# EAGLE schematic dmgK_v17 (EAGLE 9.7.0)
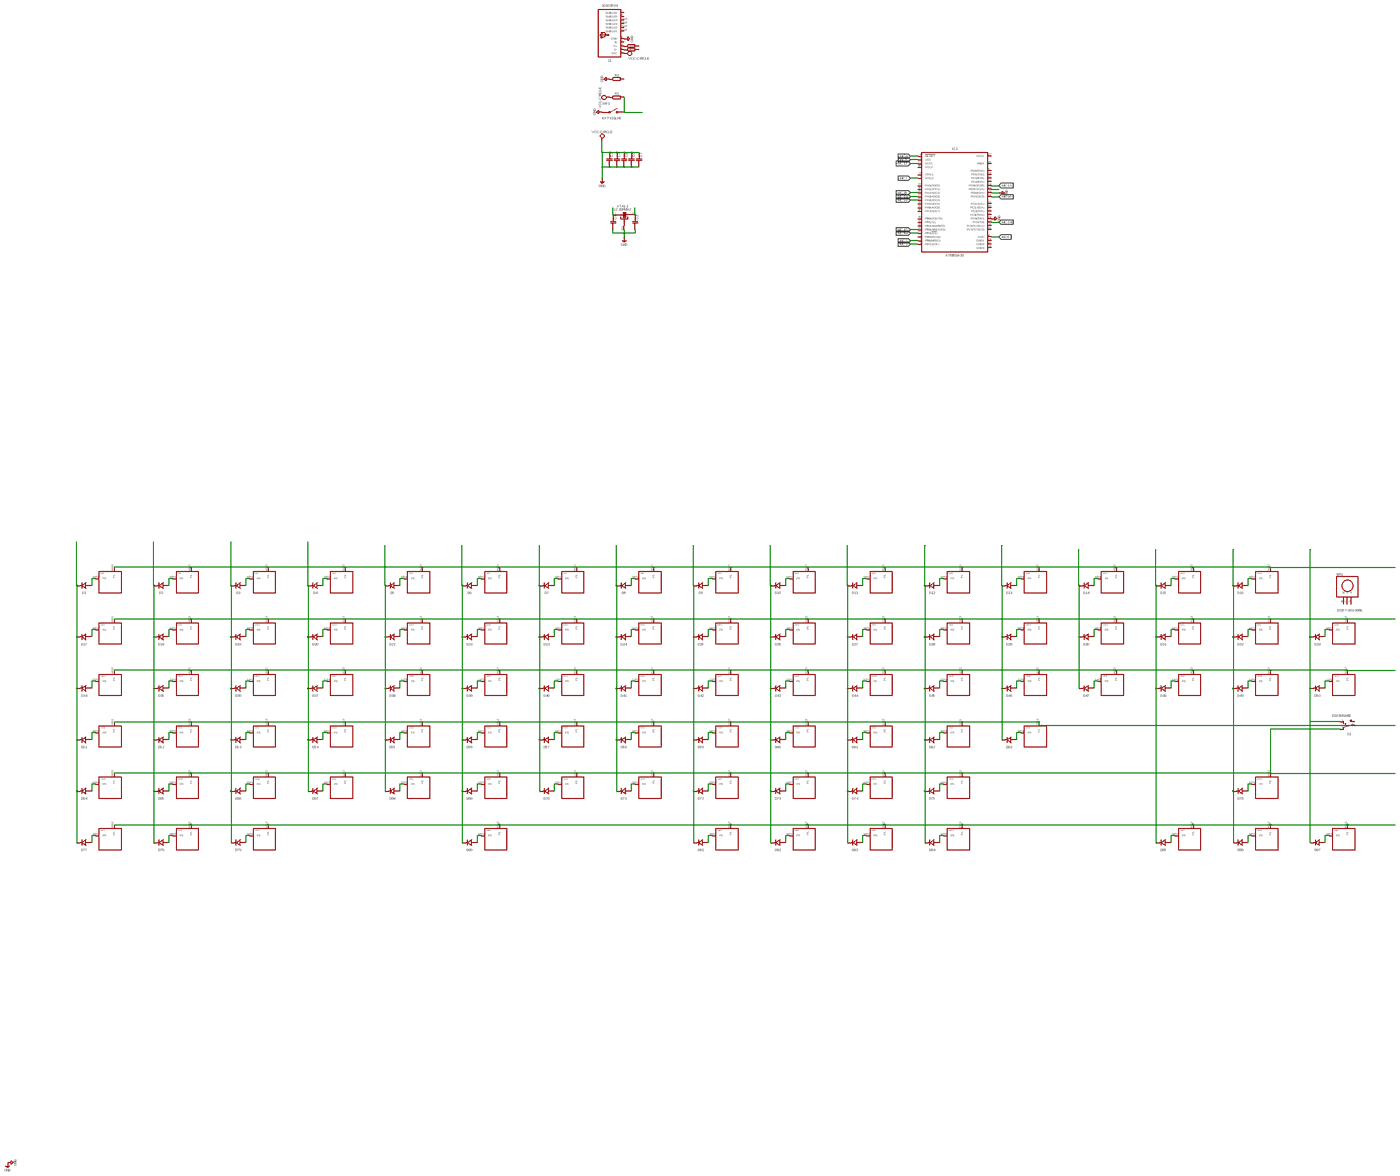
[diagram p0: schematic, sheet 1, overview]
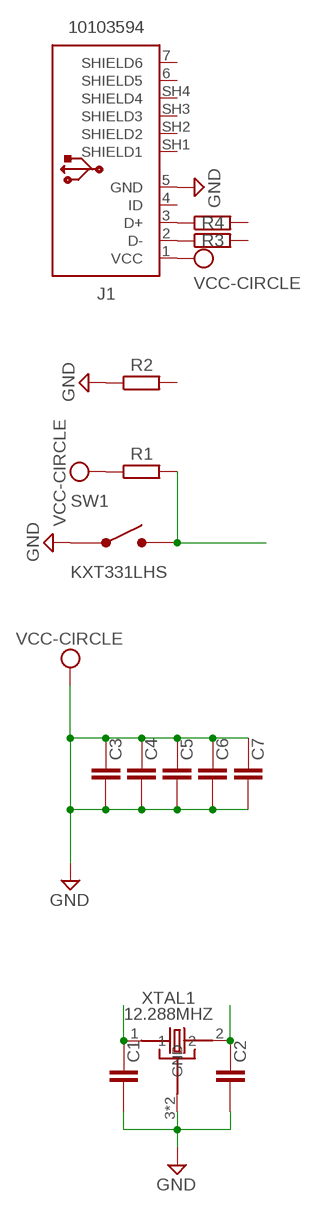
[diagram p1: schematic, sheet 1, part 1 of 6]
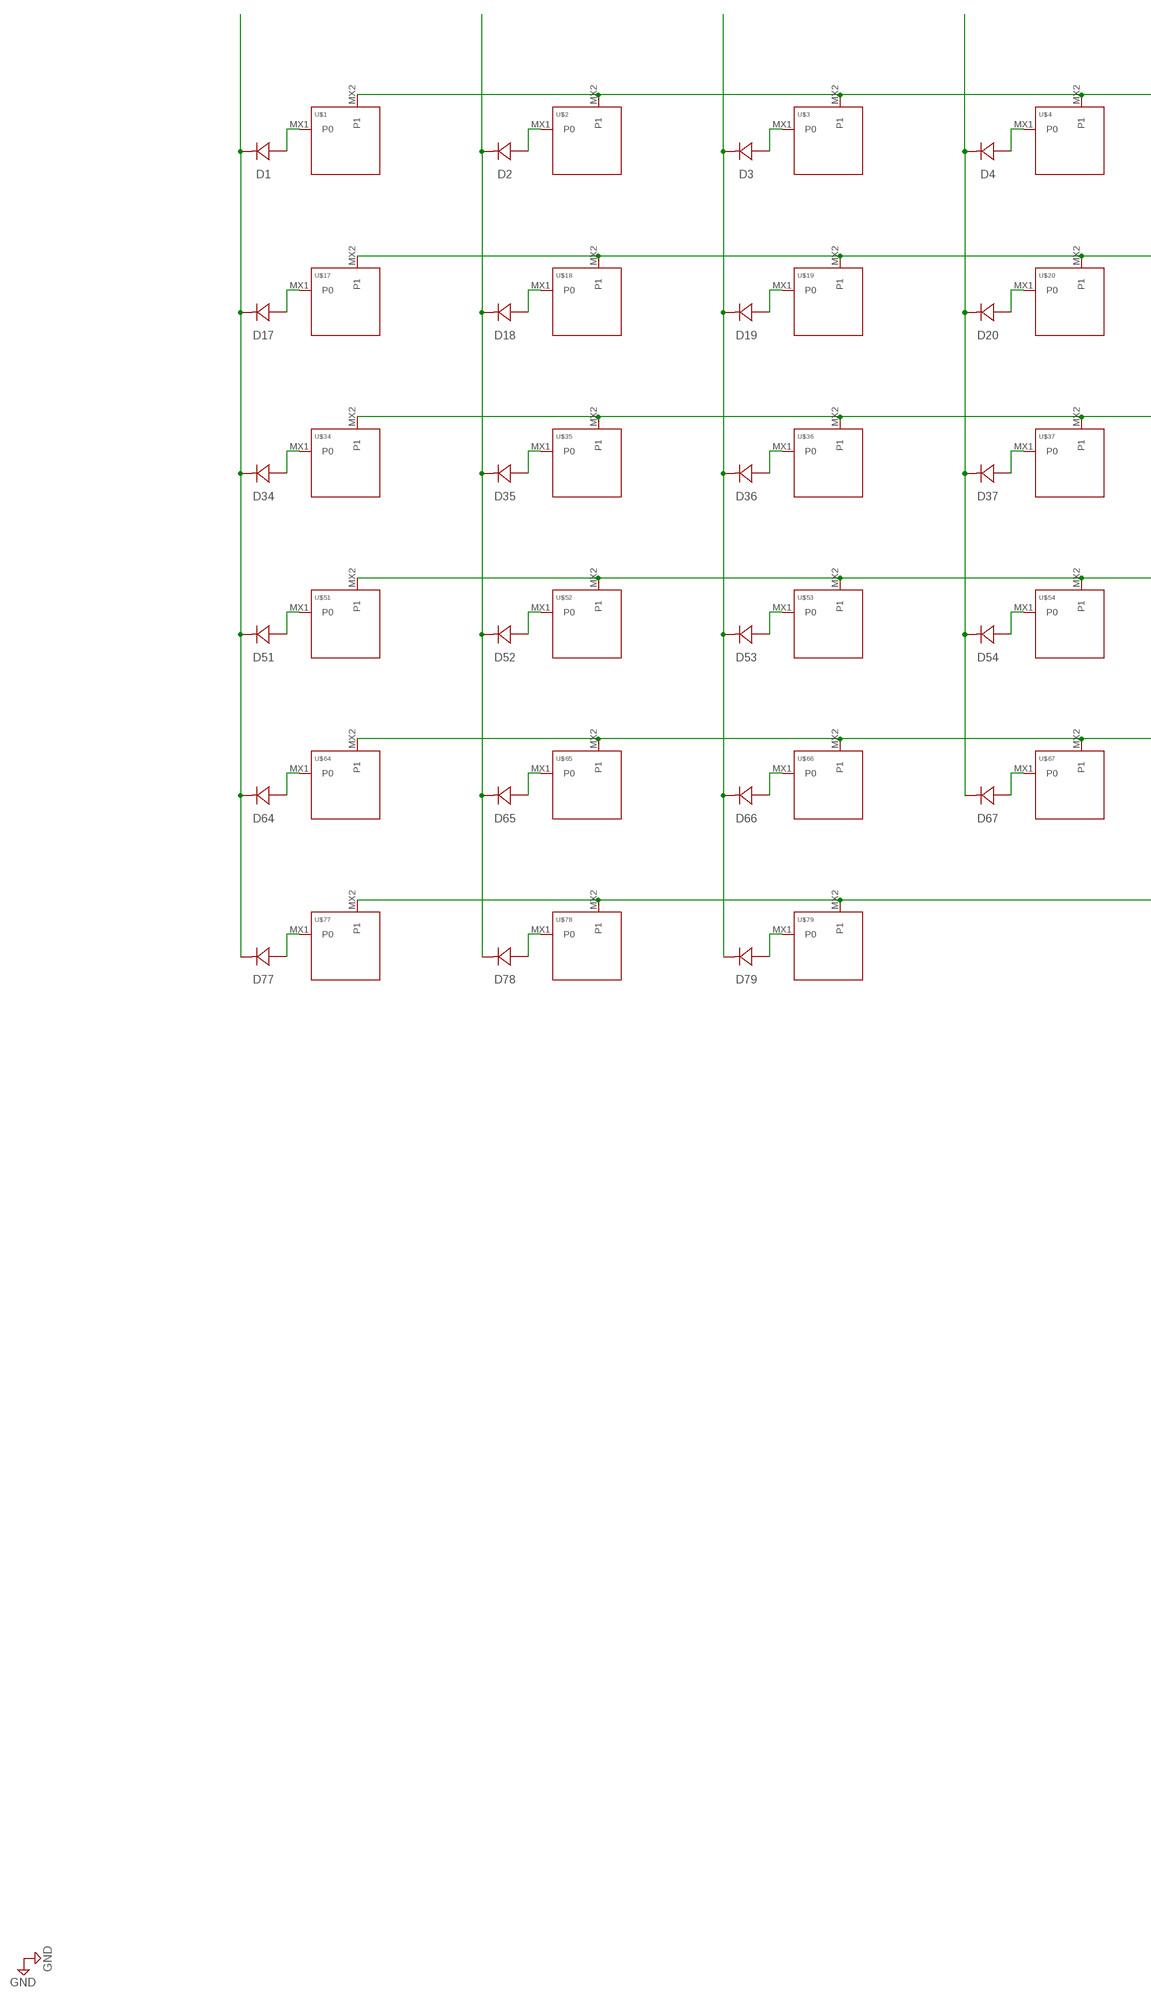
[diagram p2: schematic, sheet 1, part 2 of 6]
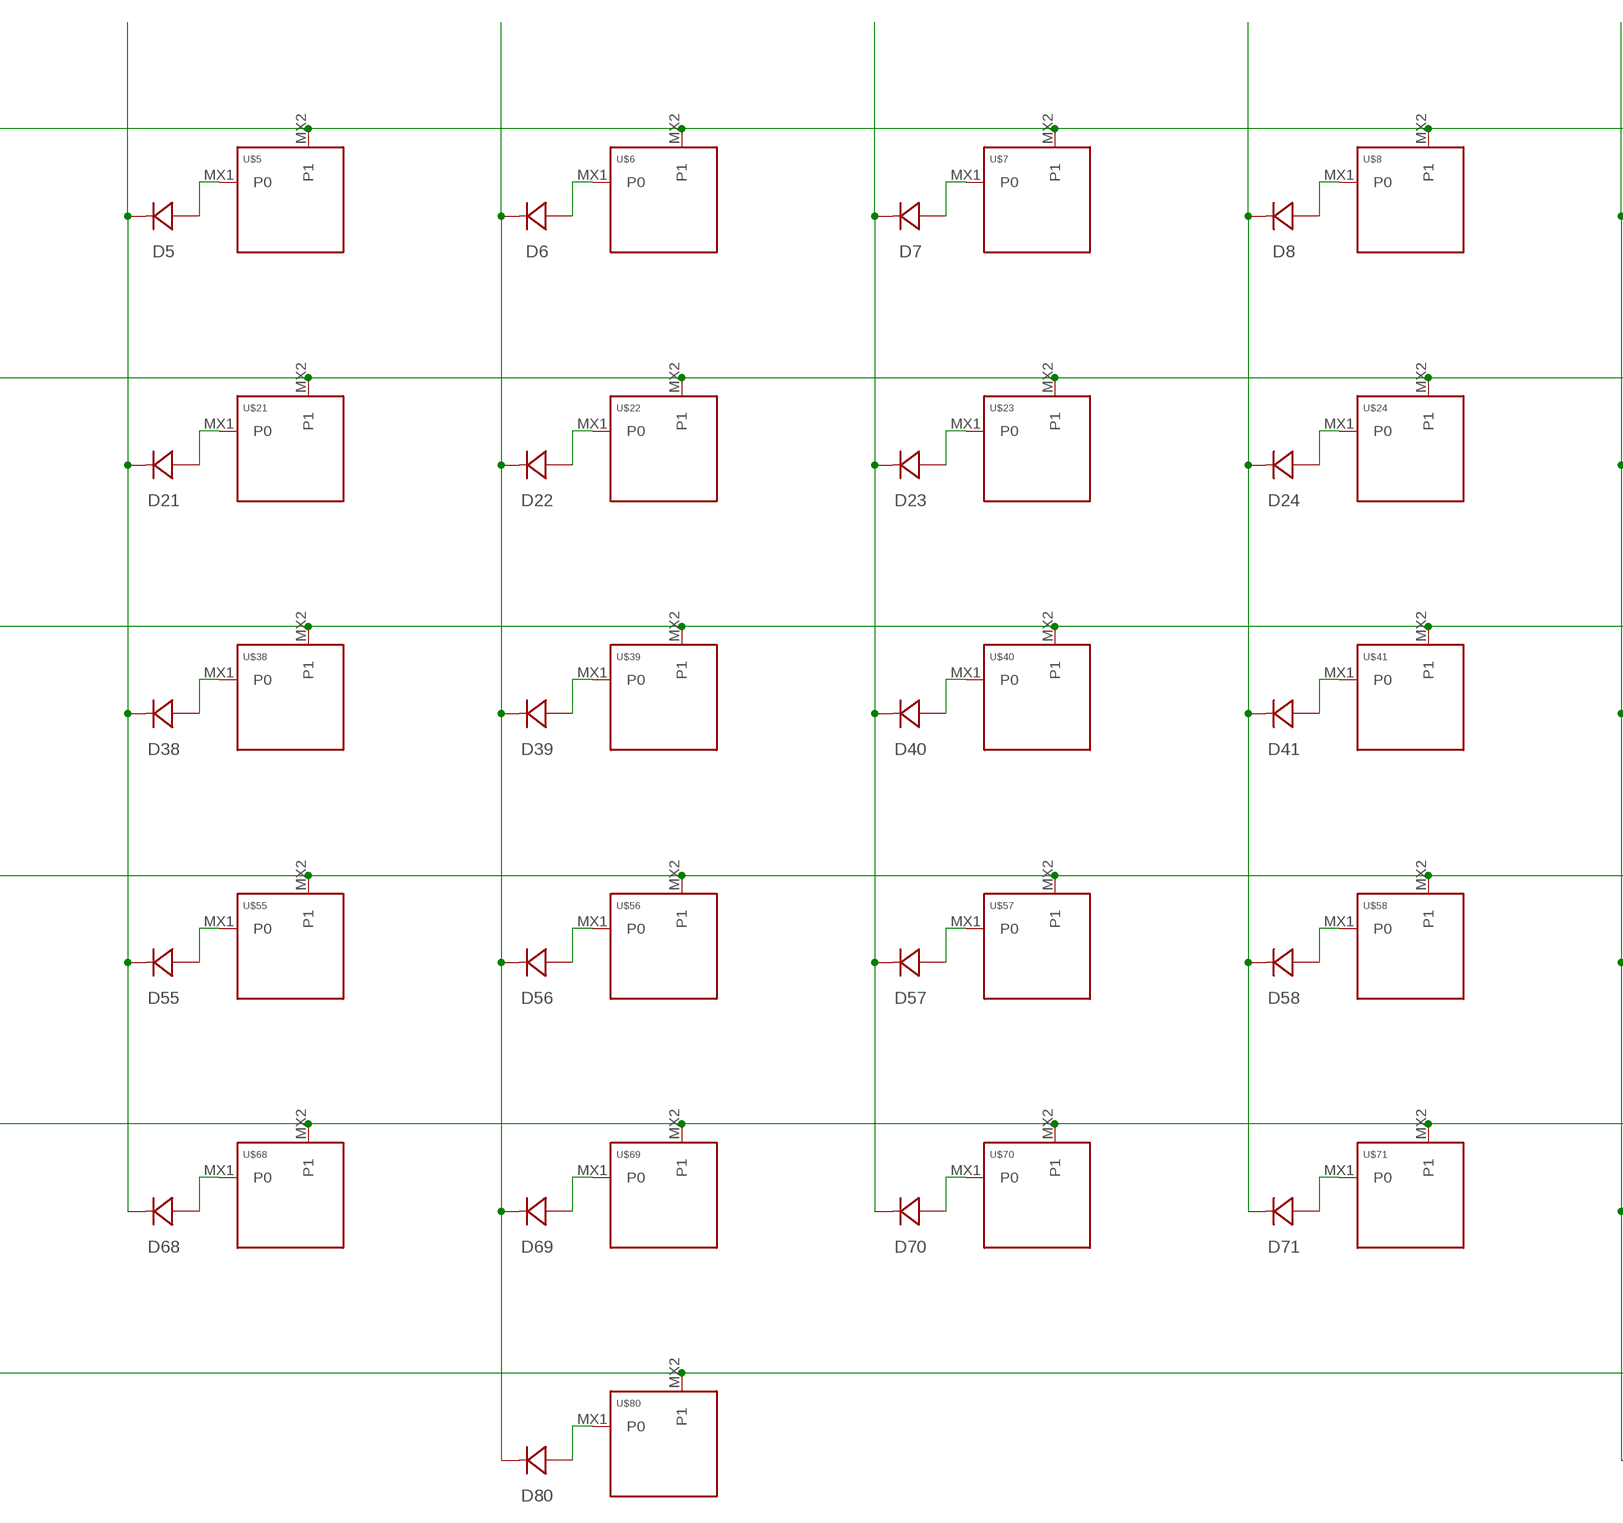
[diagram p3: schematic, sheet 1, part 3 of 6]
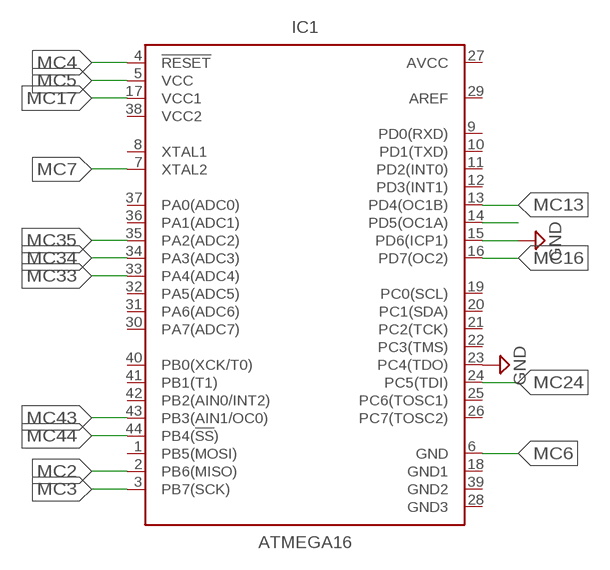
[diagram p4: schematic, sheet 1, part 4 of 6]
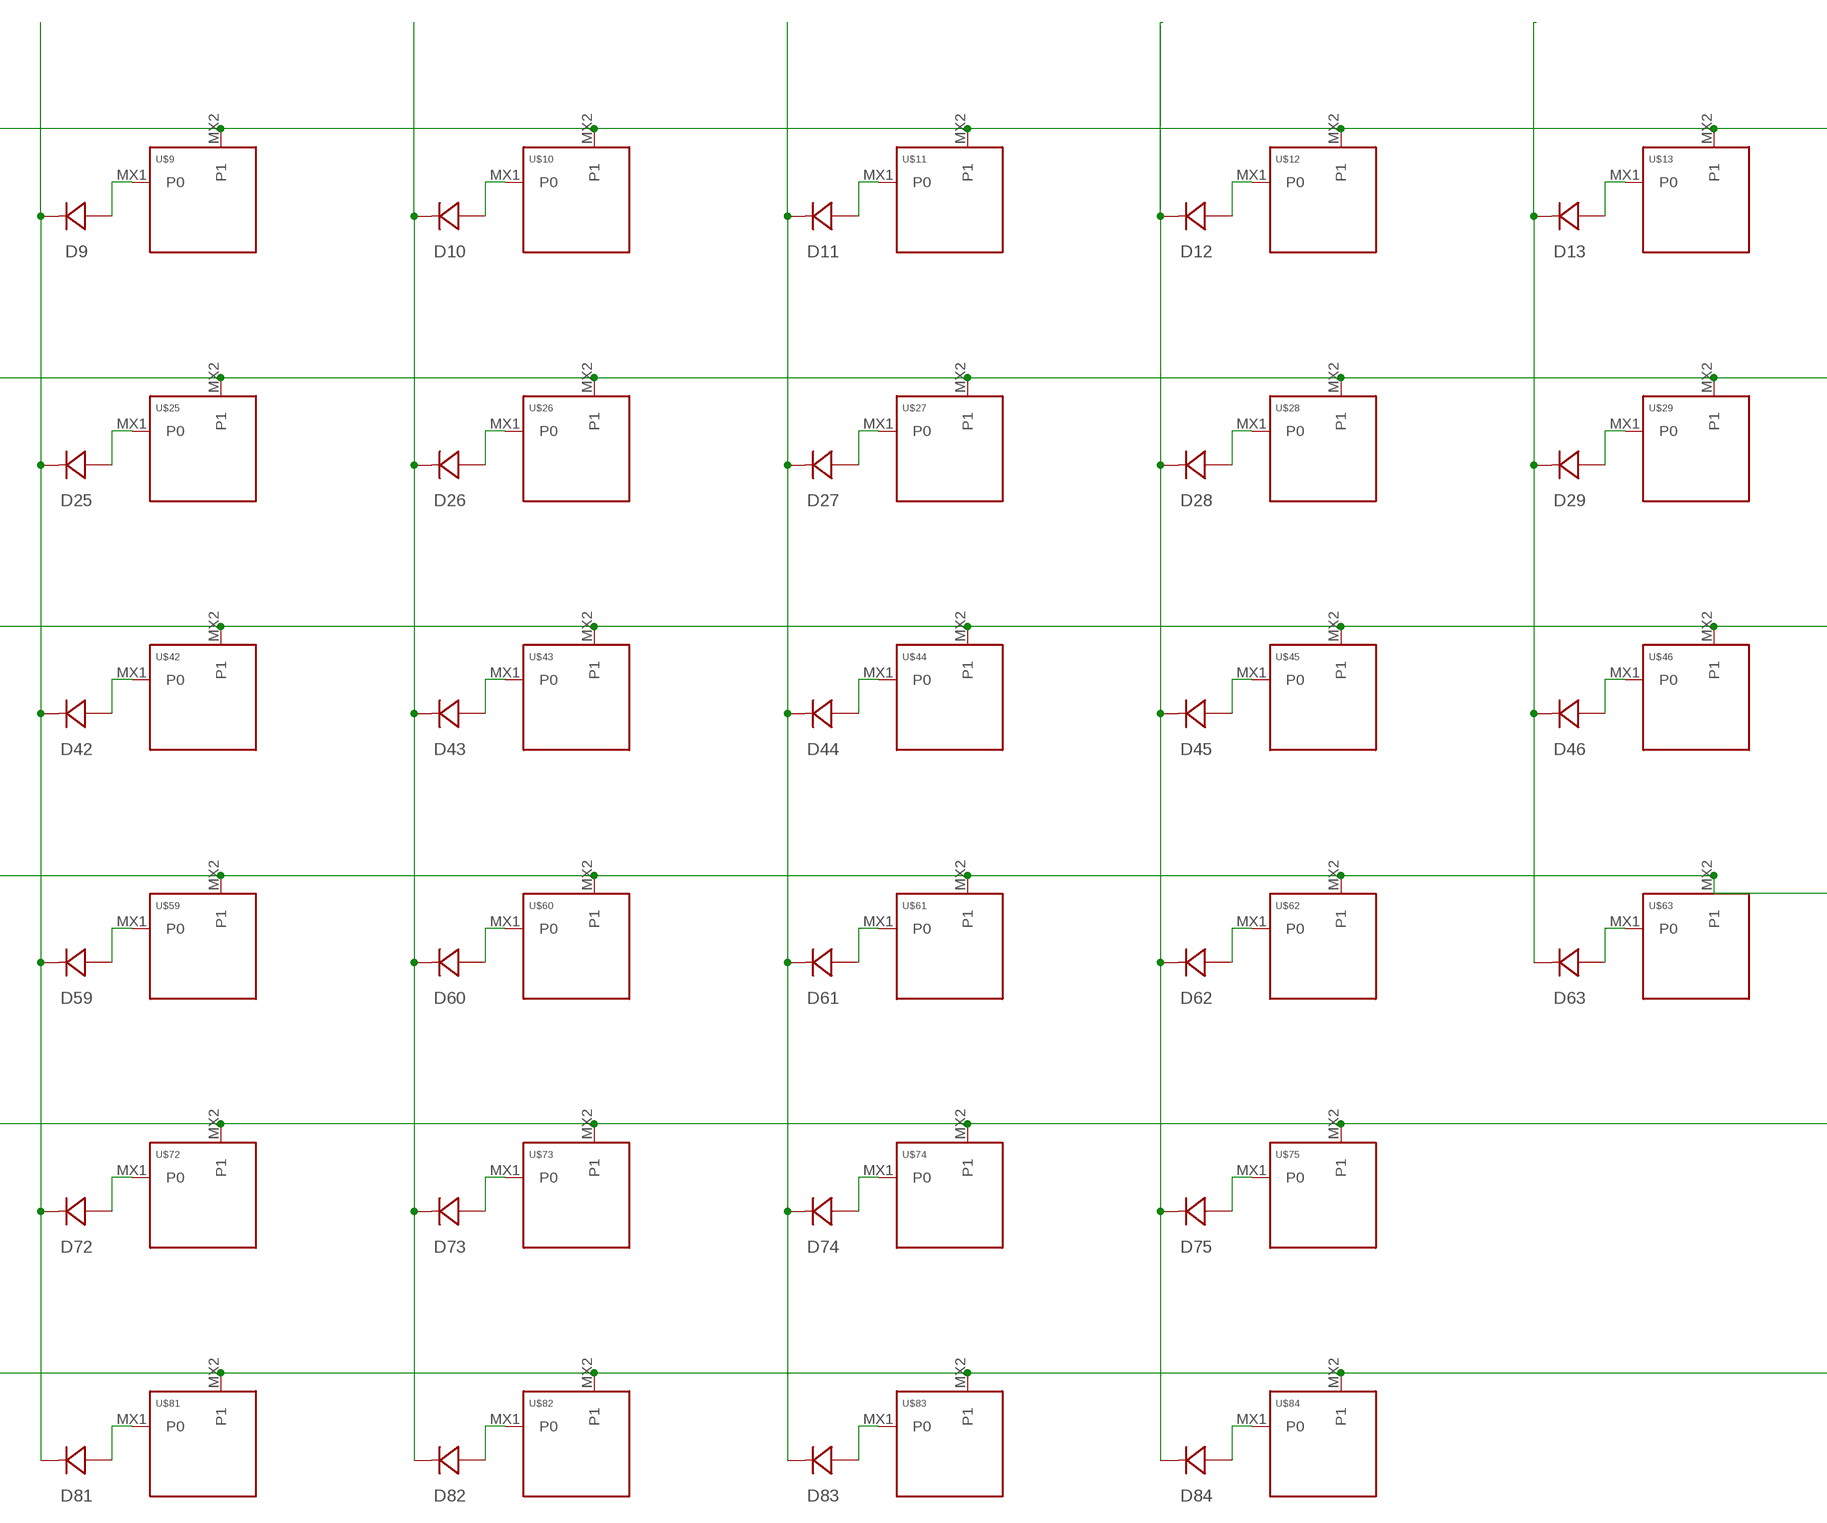
[diagram p5: schematic, sheet 1, part 5 of 6]
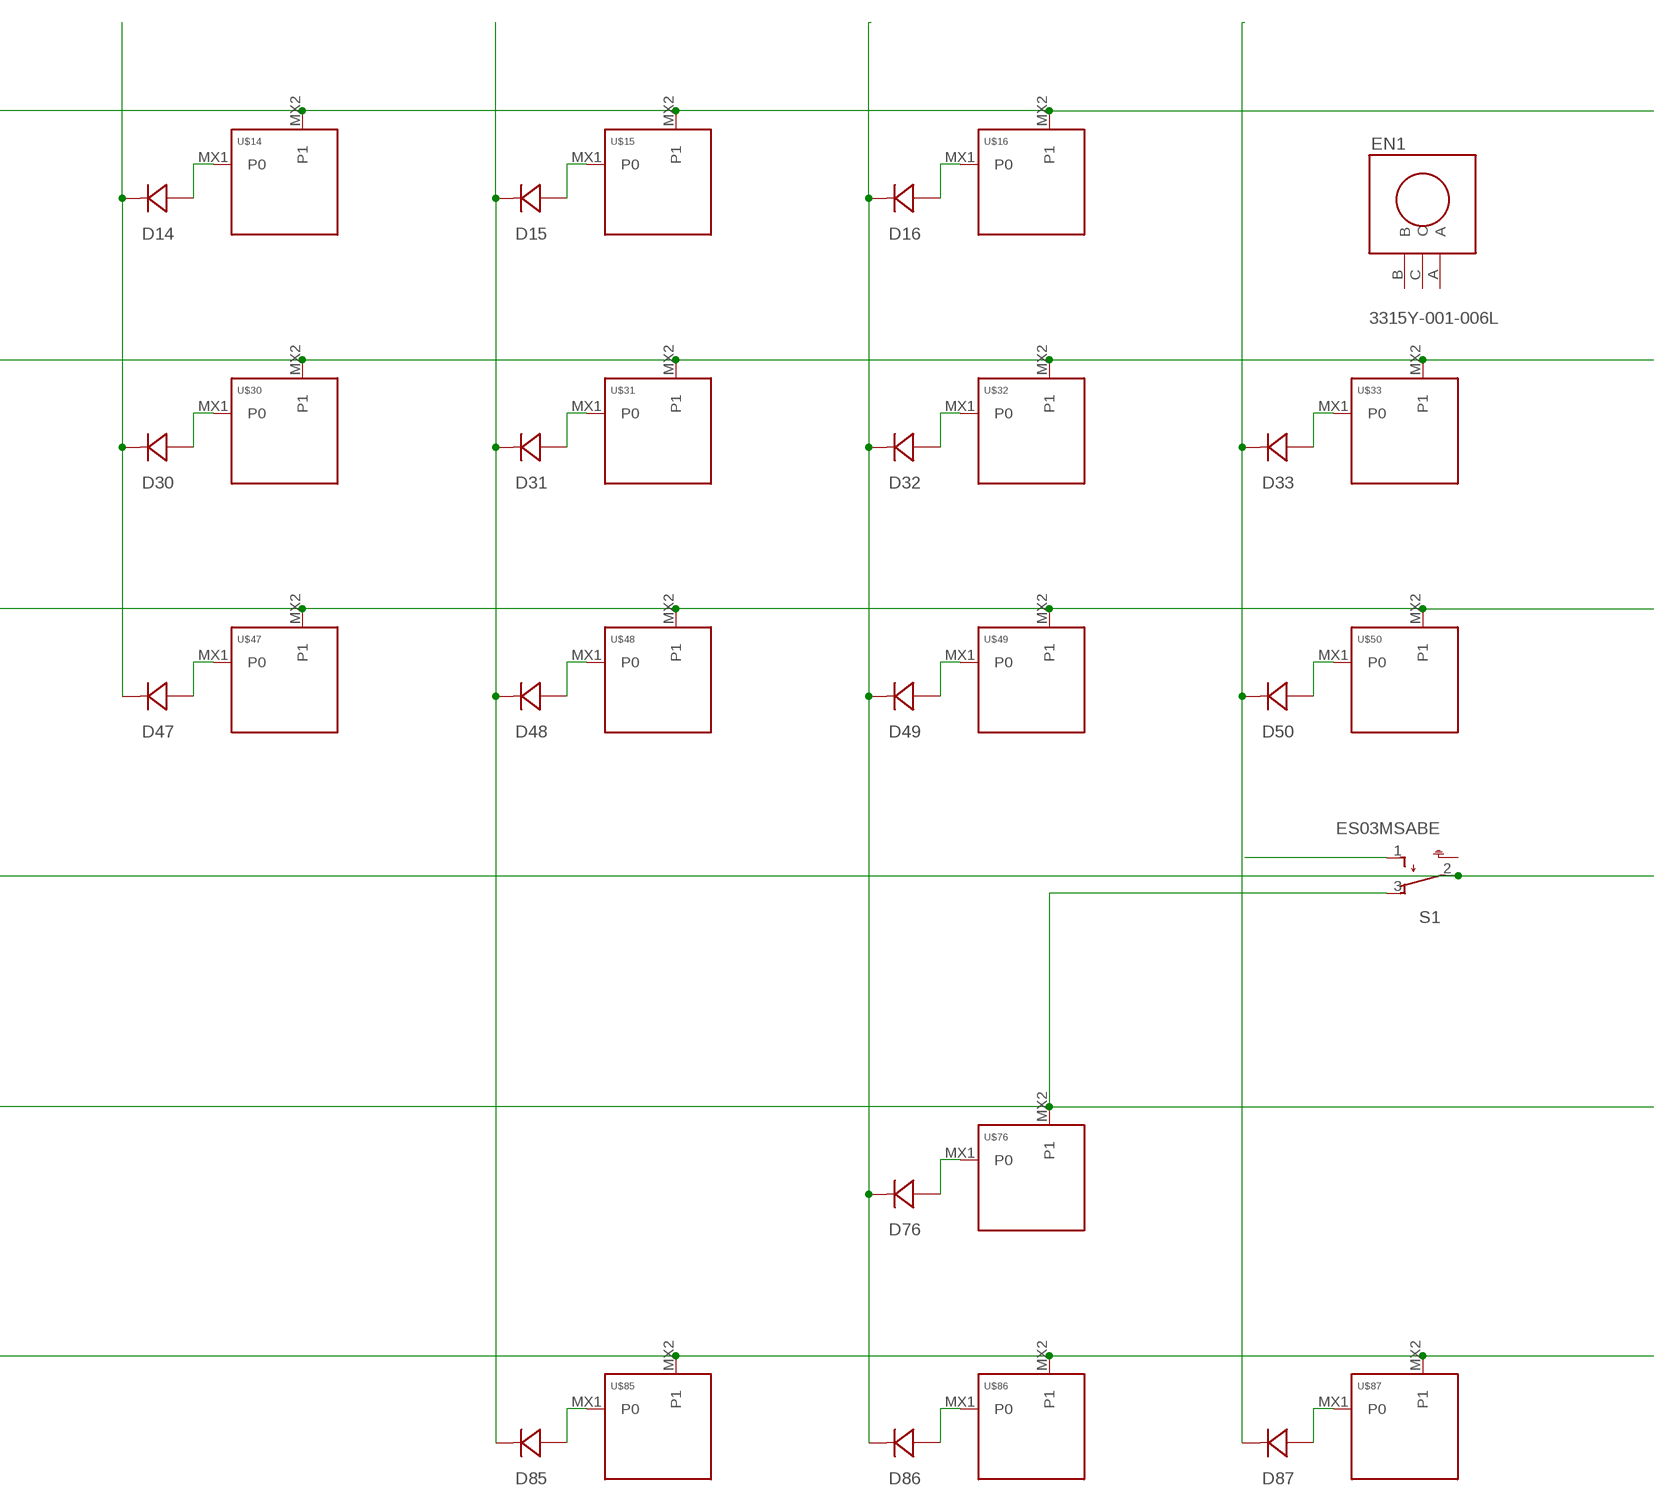
[diagram p6: schematic, sheet 1, part 6 of 6]

## Parts
C1  CAPACITOR-0405  [C0402]
C2  CAPACITOR-0405  [C0402]
C3  CAPACITOR-0405  [C0402]
C4  CAPACITOR-0405  [C0402]
C5  CAPACITOR-0405  [C0402]
C6  CAPACITOR-0405  [C0402]
C7  CAPACITOR-0405  [C0402]
D1  DIODE  DIODE-SOD-123  [SOD-123]
D2  DIODE  DIODE-SOD-123  [SOD-123]
D3  DIODE  DIODE-SOD-123  [SOD-123]
D4  DIODE  DIODE-SOD-123  [SOD-123]
D5  DIODE  DIODE-SOD-123  [SOD-123]
D6  DIODE  DIODE-SOD-123  [SOD-123]
D7  DIODE  DIODE-SOD-123  [SOD-123]
D8  DIODE  DIODE-SOD-123  [SOD-123]
D9  DIODE  DIODE-SOD-123  [SOD-123]
D10  DIODE  DIODE-SOD-123  [SOD-123]
D11  DIODE  DIODE-SOD-123  [SOD-123]
D12  DIODE  DIODE-SOD-123  [SOD-123]
D13  DIODE  DIODE-SOD-123  [SOD-123]
D14  DIODE  DIODE-SOD-123  [SOD-123]
D15  DIODE  DIODE-SOD-123  [SOD-123]
D16  DIODE  DIODE-SOD-123  [SOD-123]
D17  DIODE  DIODE-SOD-123  [SOD-123]
D18  DIODE  DIODE-SOD-123  [SOD-123]
D19  DIODE  DIODE-SOD-123  [SOD-123]
D20  DIODE  DIODE-SOD-123  [SOD-123]
D21  DIODE  DIODE-SOD-123  [SOD-123]
D22  DIODE  DIODE-SOD-123  [SOD-123]
D23  DIODE  DIODE-SOD-123  [SOD-123]
D24  DIODE  DIODE-SOD-123  [SOD-123]
D25  DIODE  DIODE-SOD-123  [SOD-123]
D26  DIODE  DIODE-SOD-123  [SOD-123]
D27  DIODE  DIODE-SOD-123  [SOD-123]
D28  DIODE  DIODE-SOD-123  [SOD-123]
D29  DIODE  DIODE-SOD-123  [SOD-123]
D30  DIODE  DIODE-SOD-123  [SOD-123]
D31  DIODE  DIODE-SOD-123  [SOD-123]
D32  DIODE  DIODE-SOD-123  [SOD-123]
D33  DIODE  DIODE-SOD-123  [SOD-123]
D34  DIODE  DIODE-SOD-123  [SOD-123]
D35  DIODE  DIODE-SOD-123  [SOD-123]
D36  DIODE  DIODE-SOD-123  [SOD-123]
D37  DIODE  DIODE-SOD-123  [SOD-123]
D38  DIODE  DIODE-SOD-123  [SOD-123]
D39  DIODE  DIODE-SOD-123  [SOD-123]
D40  DIODE  DIODE-SOD-123  [SOD-123]
D41  DIODE  DIODE-SOD-123  [SOD-123]
D42  DIODE  DIODE-SOD-123  [SOD-123]
D43  DIODE  DIODE-SOD-123  [SOD-123]
D44  DIODE  DIODE-SOD-123  [SOD-123]
D45  DIODE  DIODE-SOD-123  [SOD-123]
D46  DIODE  DIODE-SOD-123  [SOD-123]
D47  DIODE  DIODE-SOD-123  [SOD-123]
D48  DIODE  DIODE-SOD-123  [SOD-123]
D49  DIODE  DIODE-SOD-123  [SOD-123]
D50  DIODE  DIODE-SOD-123  [SOD-123]
D51  DIODE  DIODE-SOD-123  [SOD-123]
D52  DIODE  DIODE-SOD-123  [SOD-123]
D53  DIODE  DIODE-SOD-123  [SOD-123]
D54  DIODE  DIODE-SOD-123  [SOD-123]
D55  DIODE  DIODE-SOD-123  [SOD-123]
D56  DIODE  DIODE-SOD-123  [SOD-123]
D57  DIODE  DIODE-SOD-123  [SOD-123]
D58  DIODE  DIODE-SOD-123  [SOD-123]
D59  DIODE  DIODE-SOD-123  [SOD-123]
D60  DIODE  DIODE-SOD-123  [SOD-123]
D61  DIODE  DIODE-SOD-123  [SOD-123]
D62  DIODE  DIODE-SOD-123  [SOD-123]
D63  DIODE  DIODE-SOD-123  [SOD-123]
D64  DIODE  DIODE-SOD-123  [SOD-123]
D65  DIODE  DIODE-SOD-123  [SOD-123]
D66  DIODE  DIODE-SOD-123  [SOD-123]
D67  DIODE  DIODE-SOD-123  [SOD-123]
D68  DIODE  DIODE-SOD-123  [SOD-123]
D69  DIODE  DIODE-SOD-123  [SOD-123]
D70  DIODE  DIODE-SOD-123  [SOD-123]
D71  DIODE  DIODE-SOD-123  [SOD-123]
D72  DIODE  DIODE-SOD-123  [SOD-123]
D73  DIODE  DIODE-SOD-123  [SOD-123]
D74  DIODE  DIODE-SOD-123  [SOD-123]
D75  DIODE  DIODE-SOD-123  [SOD-123]
D76  DIODE  DIODE-SOD-123  [SOD-123]
D77  DIODE  DIODE-SOD-123  [SOD-123]
D78  DIODE  DIODE-SOD-123  [SOD-123]
D79  DIODE  DIODE-SOD-123  [SOD-123]
D80  DIODE  DIODE-SOD-123  [SOD-123]
D81  DIODE  DIODE-SOD-123  [SOD-123]
D82  DIODE  DIODE-SOD-123  [SOD-123]
D83  DIODE  DIODE-SOD-123  [SOD-123]
D84  DIODE  DIODE-SOD-123  [SOD-123]
D85  DIODE  DIODE-SOD-123  [SOD-123]
D86  DIODE  DIODE-SOD-123  [SOD-123]
D87  DIODE  DIODE-SOD-123  [SOD-123]
EN1  3315Y-001-006L  [3315Y-001-006L]
IC1  ATMEGA16  MC-16AQR_  [QFP80P1200X1200X120-44]
J1  10103594  [10103594]
R1  R_CHIP-0402(1005-METRIC)  [RESC1005X40]
R2  R_CHIP-0402(1005-METRIC)  [RESC1005X40]
R3  R_CHIP-0402(1005-METRIC)  [RESC1005X40]
R4  R_CHIP-0402(1005-METRIC)  [RESC1005X40]
S1  ES03MSABE  [ES03MSABE]
SW1  KXT331LHS  [KXT331LHS]
U$1  KS-MXHSPCB-1.0U  [MXHSPCB-1U]
U$2  KS-MXHSPCB-1.0U  [MXHSPCB-1U]
U$3  KS-MXHSPCB-1.0U  [MXHSPCB-1U]
U$4  KS-MXHSPCB-1.0U  [MXHSPCB-1U]
U$5  KS-MXHSPCB-1.0U  [MXHSPCB-1U]
U$6  KS-MXHSPCB-1.0U  [MXHSPCB-1U]
U$7  KS-MXHSPCB-1.0U  [MXHSPCB-1U]
U$8  KS-MXHSPCB-1.0U  [MXHSPCB-1U]
U$9  KS-MXHSPCB-1.0U  [MXHSPCB-1U]
U$10  KS-MXHSPCB-1.0U  [MXHSPCB-1U]
U$11  KS-MXHSPCB-1.0U  [MXHSPCB-1U]
U$12  KS-MXHSPCB-1.0U  [MXHSPCB-1U]
U$13  KS-MXHSPCB-1.0U  [MXHSPCB-1U]
U$14  KS-MXHSPCB-1.0U  [MXHSPCB-1U]
U$15  KS-MXHSPCB-1.0U  [MXHSPCB-1U]
U$16  KS-MXHSPCB-1.0U  [MXHSPCB-1U]
U$17  KS-MXHSPCB-1.0U  [MXHSPCB-1U]
U$18  KS-MXHSPCB-1.0U  [MXHSPCB-1U]
U$19  KS-MXHSPCB-1.0U  [MXHSPCB-1U]
U$20  KS-MXHSPCB-1.0U  [MXHSPCB-1U]
U$21  KS-MXHSPCB-1.0U  [MXHSPCB-1U]
U$22  KS-MXHSPCB-1.0U  [MXHSPCB-1U]
U$23  KS-MXHSPCB-1.0U  [MXHSPCB-1U]
U$24  KS-MXHSPCB-1.0U  [MXHSPCB-1U]
U$25  KS-MXHSPCB-1.0U  [MXHSPCB-1U]
U$26  KS-MXHSPCB-1.0U  [MXHSPCB-1U]
U$27  KS-MXHSPCB-1.0U  [MXHSPCB-1U]
U$28  KS-MXHSPCB-1.0U  [MXHSPCB-1U]
U$29  KS-MXHSPCB-1.0U  [MXHSPCB-1U]
U$30  KS-MXHSPCB-2.0U  [MXHSPCB-2U]
U$31  KS-MXHSPCB-1.0U  [MXHSPCB-1U]
U$32  KS-MXHSPCB-1.0U  [MXHSPCB-1U]
U$33  KS-MXHSPCB-1.0U  [MXHSPCB-1U]
U$34  KS-MXHSPCB-1.5U  [MXHSPCB-1.5U]
U$35  KS-MXHSPCB-1.0U  [MXHSPCB-1U]
U$36  KS-MXHSPCB-1.0U  [MXHSPCB-1U]
U$37  KS-MXHSPCB-1.0U  [MXHSPCB-1U]
U$38  KS-MXHSPCB-1.0U  [MXHSPCB-1U]
U$39  KS-MXHSPCB-1.0U  [MXHSPCB-1U]
U$40  KS-MXHSPCB-1.0U  [MXHSPCB-1U]
U$41  KS-MXHSPCB-1.0U  [MXHSPCB-1U]
U$42  KS-MXHSPCB-1.0U  [MXHSPCB-1U]
U$43  KS-MXHSPCB-1.0U  [MXHSPCB-1U]
U$44  KS-MXHSPCB-1.0U  [MXHSPCB-1U]
U$45  KS-MXHSPCB-1.0U  [MXHSPCB-1U]
U$46  KS-MXHSPCB-1.0U  [MXHSPCB-1U]
U$47  KS-MXHSPCB-1.5U  [MXHSPCB-1.5U]
U$48  KS-MXHSPCB-1.0U  [MXHSPCB-1U]
U$49  KS-MXHSPCB-1.0U  [MXHSPCB-1U]
U$50  KS-MXHSPCB-1.0U  [MXHSPCB-1U]
U$51  KS-MXHSPCB-1.75U  [MXHSPCB-1.75U]
U$52  KS-MXHSPCB-1.0U  [MXHSPCB-1U]
U$53  KS-MXHSPCB-1.0U  [MXHSPCB-1U]
U$54  KS-MXHSPCB-1.0U  [MXHSPCB-1U]
U$55  KS-MXHSPCB-1.0U  [MXHSPCB-1U]
U$56  KS-MXHSPCB-1.0U  [MXHSPCB-1U]
U$57  KS-MXHSPCB-1.0U  [MXHSPCB-1U]
U$58  KS-MXHSPCB-1.0U  [MXHSPCB-1U]
U$59  KS-MXHSPCB-1.0U  [MXHSPCB-1U]
U$60  KS-MXHSPCB-1.0U  [MXHSPCB-1U]
U$61  KS-MXHSPCB-1.0U  [MXHSPCB-1U]
U$62  KS-MXHSPCB-1.0U  [MXHSPCB-1U]
U$63  KS-MXHSPCB-2.25U  [MXHSPCB-2.25U]
U$64  KS-MXHSPCB-2.25U  [MXHSPCB-2.25U]
U$65  KS-MXHSPCB-1.0U  [MXHSPCB-1U]
U$66  KS-MXHSPCB-1.0U  [MXHSPCB-1U]
U$67  KS-MXHSPCB-1.0U  [MXHSPCB-1U]
U$68  KS-MXHSPCB-1.0U  [MXHSPCB-1U]
U$69  KS-MXHSPCB-1.0U  [MXHSPCB-1U]
U$70  KS-MXHSPCB-1.0U  [MXHSPCB-1U]
U$71  KS-MXHSPCB-1.0U  [MXHSPCB-1U]
U$72  KS-MXHSPCB-1.0U  [MXHSPCB-1U]
U$73  KS-MXHSPCB-1.0U  [MXHSPCB-1U]
U$74  KS-MXHSPCB-1.0U  [MXHSPCB-1U]
U$75  KSMXHSPCB-2.75U  [MXHSPCB-2.75U]
U$76  KS-MXHSPCB-1.0U  [MXHSPCB-1U]
U$77  KS-MXHSPCB-1.25U  [MXHSPCB-1.25U]
U$78  KS-MXHSPCB-1.25U  [MXHSPCB-1.25U]
U$79  KS-MXHSPCB-1.25U  [MXHSPCB-1.25U]
U$80  KS-MXHSPCB-6.25U  [MXHSPCB-6.25U]
U$81  KS-MXHSPCB-1.25U  [MXHSPCB-1.25U]
U$82  KS-MXHSPCB-1.25U  [MXHSPCB-1.25U]
U$83  KS-MXHSPCB-1.25U  [MXHSPCB-1.25U]
U$84  KS-MXHSPCB-1.25U  [MXHSPCB-1.25U]
U$85  KS-MXHSPCB-1.0U  [MXHSPCB-1U]
U$86  KS-MXHSPCB-1.0U  [MXHSPCB-1U]
U$87  KS-MXHSPCB-1.0U  [MXHSPCB-1U]
XTAL1  12.288MHZ  ABM3BFREQUENCY_12.288MHZ  [OSCSC500X320X110-4N]

## Nets
GND: C1.2 C2.2 IC1.15(PD6(ICP1)) IC1.23(PC4(TDO)) J1.5(GND) R2.1 SW1.1 XTAL1.3(GND) XTAL1.4(GND)
MC2: IC1.2(PB6(MISO))
MC3: IC1.3(PB7(SCK))
MC4: IC1.4(!RESET!)
MC5: IC1.5(VCC)
MC6: IC1.6(GND)
MC7: IC1.7(XTAL2)
MC13: IC1.13(PD4(OC1B))
MC14: IC1.14(PD5(OC1A))
MC16: IC1.16(PD7(OC2))
MC17: IC1.17(VCC1)
MC24: IC1.24(PC5(TDI))
MC33: IC1.33(PA4(ADC4))
MC34: IC1.34(PA3(ADC3))
MC35: IC1.35(PA2(ADC2))
MC43: IC1.43(PB3(AIN1/OC0))
MC44: IC1.44(PB4(!SS!))
N$1: D1.A U$1.MX1(P0)
N$2: D2.A U$2.MX1(P0)
N$3: D3.A U$3.MX1(P0)
N$4: D4.A U$4.MX1(P0)
N$5: D5.A U$5.MX1(P0)
N$6: D6.A U$6.MX1(P0)
N$7: D7.A U$7.MX1(P0)
N$8: D8.A U$8.MX1(P0)
N$9: D9.A U$9.MX1(P0)
N$10: D10.A U$10.MX1(P0)
N$11: D11.A U$11.MX1(P0)
N$12: D12.A U$12.MX1(P0)
N$13: D13.A U$13.MX1(P0)
N$14: D14.A U$14.MX1(P0)
N$15: D15.A U$15.MX1(P0)
N$16: D16.A U$16.MX1(P0)
N$17: D17.A U$17.MX1(P0)
N$18: D18.A U$18.MX1(P0)
N$19: D19.A U$19.MX1(P0)
N$20: D20.A U$20.MX1(P0)
N$21: D21.A U$21.MX1(P0)
N$22: D22.A U$22.MX1(P0)
N$23: D23.A U$23.MX1(P0)
N$24: D24.A U$24.MX1(P0)
N$25: D25.A U$25.MX1(P0)
N$26: D26.A U$26.MX1(P0)
N$27: D27.A U$27.MX1(P0)
N$28: D28.A U$28.MX1(P0)
N$29: D29.A U$29.MX1(P0)
N$30: D30.A U$30.MX1(P0)
N$31: D31.A U$31.MX1(P0)
N$32: D32.A U$32.MX1(P0)
N$33: D33.A U$33.MX1(P0)
N$34: D34.A U$34.MX1(P0)
N$35: D35.A U$35.MX1(P0)
N$36: D36.A U$36.MX1(P0)
N$37: D37.A U$37.MX1(P0)
N$38: D38.A U$38.MX1(P0)
N$39: D39.A U$39.MX1(P0)
N$40: D40.A U$40.MX1(P0)
N$41: D41.A U$41.MX1(P0)
N$42: D42.A U$42.MX1(P0)
N$43: D43.A U$43.MX1(P0)
N$44: D44.A U$44.MX1(P0)
N$45: D45.A U$45.MX1(P0)
N$46: D46.A U$46.MX1(P0)
N$47: D47.A U$47.MX1(P0)
N$48: D48.A U$48.MX1(P0)
N$49: D49.A U$49.MX1(P0)
N$50: D50.A U$50.MX1(P0)
N$51: D51.A U$51.MX1(P0)
N$52: D52.A U$52.MX1(P0)
N$53: D53.A U$53.MX1(P0)
N$54: D54.A U$54.MX1(P0)
N$55: D55.A U$55.MX1(P0)
N$56: D56.A U$56.MX1(P0)
N$57: D57.A U$57.MX1(P0)
N$58: D58.A U$58.MX1(P0)
N$59: D59.A U$59.MX1(P0)
N$60: D60.A U$60.MX1(P0)
N$61: D61.A U$61.MX1(P0)
N$62: D62.A U$62.MX1(P0)
N$63: D63.A U$63.MX1(P0)
N$64: D64.A U$64.MX1(P0)
N$65: D65.A U$65.MX1(P0)
N$66: D66.A U$66.MX1(P0)
N$67: D67.A U$67.MX1(P0)
N$68: D68.A U$68.MX1(P0)
N$69: D69.A U$69.MX1(P0)
N$70: D70.A U$70.MX1(P0)
N$71: D71.A U$71.MX1(P0)
N$72: D72.A U$72.MX1(P0)
N$73: D73.A U$73.MX1(P0)
N$74: D74.A U$74.MX1(P0)
N$75: D75.A U$75.MX1(P0)
N$76: D76.A U$76.MX1(P0)
N$77: D77.A U$77.MX1(P0)
N$78: D78.A U$78.MX1(P0)
N$79: D79.A U$79.MX1(P0)
N$80: D80.A U$80.MX1(P0)
N$81: D81.A U$81.MX1(P0)
N$82: D82.A U$82.MX1(P0)
N$83: D83.A U$83.MX1(P0)
N$84: D84.A U$84.MX1(P0)
N$85: D85.A U$85.MX1(P0)
N$86: D86.A U$86.MX1(P0)
N$87: D87.A U$87.MX1(P0)
N$88: U$1.MX2(P1) U$2.MX2(P1) U$3.MX2(P1) U$4.MX2(P1) U$5.MX2(P1) U$6.MX2(P1) U$7.MX2(P1) U$8.MX2(P1) U$9.MX2(P1) U$10.MX2(P1) U$11.MX2(P1) U$12.MX2(P1) U$13.MX2(P1) U$14.MX2(P1) U$15.MX2(P1) U$16.MX2(P1)
N$89: U$17.MX2(P1) U$18.MX2(P1) U$19.MX2(P1) U$20.MX2(P1) U$21.MX2(P1) U$22.MX2(P1) U$23.MX2(P1) U$24.MX2(P1) U$25.MX2(P1) U$26.MX2(P1) U$27.MX2(P1) U$28.MX2(P1) U$29.MX2(P1) U$30.MX2(P1) U$31.MX2(P1) U$32.MX2(P1) U$33.MX2(P1)
N$90: U$34.MX2(P1) U$35.MX2(P1) U$36.MX2(P1) U$37.MX2(P1) U$38.MX2(P1) U$39.MX2(P1) U$40.MX2(P1) U$41.MX2(P1) U$42.MX2(P1) U$43.MX2(P1) U$44.MX2(P1) U$45.MX2(P1) U$46.MX2(P1) U$47.MX2(P1) U$48.MX2(P1) U$49.MX2(P1) U$50.MX2(P1)
N$91: S1.2 U$51.MX2(P1) U$52.MX2(P1) U$53.MX2(P1) U$54.MX2(P1) U$55.MX2(P1) U$56.MX2(P1) U$57.MX2(P1) U$58.MX2(P1) U$59.MX2(P1) U$60.MX2(P1) U$61.MX2(P1) U$62.MX2(P1) U$63.MX2(P1)
N$92: S1.3 U$64.MX2(P1) U$65.MX2(P1) U$66.MX2(P1) U$67.MX2(P1) U$68.MX2(P1) U$69.MX2(P1) U$70.MX2(P1) U$71.MX2(P1) U$72.MX2(P1) U$73.MX2(P1) U$74.MX2(P1) U$75.MX2(P1) U$76.MX2(P1)
N$93: U$77.MX2(P1) U$78.MX2(P1) U$79.MX2(P1) U$80.MX2(P1) U$81.MX2(P1) U$82.MX2(P1) U$83.MX2(P1) U$84.MX2(P1) U$85.MX2(P1) U$86.MX2(P1) U$87.MX2(P1)
N$94: D33.C D50.C D87.C
N$95: D16.C D32.C D49.C D76.C D86.C
N$96: D15.C D31.C D48.C D85.C
N$97: D14.C D30.C D47.C
N$98: D13.C D29.C D46.C D63.C
N$99: D12.C D28.C D45.C D62.C D75.C D84.C
N$100: D11.C D27.C D44.C D61.C D74.C D83.C
N$101: D10.C D26.C D43.C D60.C D73.C D82.C
N$102: D9.C D25.C D42.C D59.C D72.C D81.C
N$103: D8.C D24.C D41.C D58.C D71.C
N$104: D7.C D23.C D40.C D57.C D70.C
N$105: D6.C D22.C D39.C D56.C D69.C D80.C
N$106: D5.C D21.C D38.C D55.C D68.C
N$107: D4.C D20.C D37.C D54.C D67.C
N$108: D3.C D19.C D36.C D53.C D66.C D79.C
N$109: D2.C D18.C D35.C D52.C D65.C D78.C
N$110: D1.C D17.C D34.C D51.C D64.C D77.C
N$111: C1.1 XTAL1.1
N$112: C2.1 XTAL1.2
N$113: R1.2 SW1.2
N$114: J1.3(D+) R4.1
N$115: J1.2(D-) R3.1
N$116: S1.1
VCC: C3.1 C3.2 C4.1 C4.2 C5.1 C5.2 C6.1 C6.2 C7.1 C7.2 J1.1(VCC) R1.1 ; supply symbol labelled GND, VCC-CIRCLE
Unconnected: EN1.A EN1.B EN1.C IC1.1(PB5(MOSI)) IC1.8(XTAL1) IC1.9(PD0(RXD)) IC1.10(PD1(TXD)) IC1.11(PD2(INT0)) IC1.12(PD3(INT1)) IC1.19(PC0(SCL)) IC1.20(PC1(SDA)) IC1.21(PC2(TCK)) IC1.22(PC3(TMS)) IC1.25(PC6(TOSC1)) IC1.26(PC7(TOSC2)) IC1.29(AREF) IC1.30(PA7(ADC7)) IC1.31(PA6(ADC6)) IC1.32(PA5(ADC5)) IC1.36(PA1(ADC1)) IC1.37(PA0(ADC0)) IC1.40(PB0(XCK/T0)) IC1.41(PB1(T1)) IC1.42(PB2(AIN0/INT2)) J1.4(ID) J1.6(SHIELD5) J1.7(SHIELD6) J1.SH1(SHIELD1) J1.SH2(SHIELD2) J1.SH3(SHIELD3) J1.SH4(SHIELD4) R2.2 R3.2 R4.2 S1.S1(SH) S1.S2(SH)

## Power pins joined to a net without a drawn wire
AVCC: IC1.27(AVCC)
GND1: IC1.18(GND1)
GND2: IC1.39(GND2)
GND3: IC1.28(GND3)
VCC2: IC1.38(VCC2)

## Library data of the parts
C1-C7 = Controller:CAPACITOR
D1-D87 = Controller:DIODE: Standard 1N4148 diode
EN1 = Encoders:3315Y-001-006L: ROTARY ENCODER MECHANICAL 6PPR Manufacturer's datasheet <https://www.bourns.com/docs/Product-Datasheets/3315.pdf>; CREATED_BY: PCBLayout.com; DIGIKEY_PARTNO: 3315Y-001-006L-ND; MANUFACTURER: Bourns Inc.; MPN: 3315Y-001-006L
IC1 = TL:MC: 8-bit Microcontroller with 32KBytes In-System Programmable Flash Datasheet <http://ww1.microchip.com/downloads/en/DeviceDoc/doc2503.pdf>; CATEGORY: IC_Embedded; DESCRIPTION: IC MCU 8BIT 32KB FLASH 44TQFP; MANUFACTURER: Microchip Technology; MPN: ATMEGA32-16AQR; OPERATING_TEMP: -40°C to 105°C; PART_STATUS: Active; SERIES: AVR® ATmega; SPEED: 16MHz; SUB-CATEGORY: Microcontroller
J1 = Connector_USB:10103594: USB(2.0) Micro-B, RCPT, 5POS, SMD-THT-R/A Datasheet <https://cdn.amphenol-icc.com/media/wysiwyg/files/documentation/datasheet/inputoutput/io_usb_micro.pdf> Drawing <https://cdn.amphenol-icc.com/media/wysiwyg/files/drawing/10103594.pdf>; CATEGORY: Connectors; CONTACTS: 5; CURRENT-RATING: 1.8A; DESCRIPTION: CONN RCPT USB2.0 MICRO B SMD R/A; GENDER: Receptacle; MANUFACTURER: Amphenol ICC (FCI); MOUNT_TYPE: R/A; MPN: 10103594-0001LF; OPERATING_TEMPERATURE: -30°C ~ 80°C; PART_STATUS: ACTIVE; ROHS_COMPLIANT: COMPLIANT; SUB_CATEGORY: USB; TYPE: USB-micro B; VOLTAGE-RATING: 100VAC
R1-R4 = Resistor:R: Resistor Fixed - Generic; CATEGORY: Resistor; SUB-CATEGORY: Fixed
S1 = Switch:ES03MSABE: SWITCH SLIDE SPDT 0.4VA 20V Manufacturer's datasheet <https://www.ckswitches.com/media/1421/es.pdf>; CREATED_BY: PCBLayout.com; DIGIKEY_PARTNO: CKN2086TR-ND; MANUFACTURER: C&K; MPN: ES03MSABE
SW1 = Switch:KXT331LHS: SWITCH TACTILE SPST-NO 0.02A 15V Manufacturer's datasheet <https://dznh3ojzb2azq.cloudfront.net/products/Tactile/KXT3/documents/datasheet.pdf>; CREATED_BY: PCBLayout.com; DIGIKEY_PARTNO: CKN10779TR-ND; MANUFACTURER: C&K; MPN: KXT 331 LHS
U$1-U$87 = TL:KS
XTAL1 = Frequency-Source:ABM3B: CRYSTAL 8.0000MHZ 18PF SMD 8MHz ±20ppm Crystal 18pF 200 Ohms 4-SMD, No Lead Datasheet <https://abracon.com/Resonators/abm3b.pdf>; CATEGORY: Crystals; MAUFACTURER: Abracon LLC; MPN: ABM3B-12.288MHZ-B2-T; OPERATING_TEMPERATURE: -20°C ~ 70°C; PART_STATUS: ACIVE; ROHS_COMPLIANT: COMPLIANT; SERIES: ABM3B; SUB_CATEGORY: Crystals 4-SMD; TYPE: Crystal Surface Mount